# EAGLE design numpad (EAGLE 9.6.2)
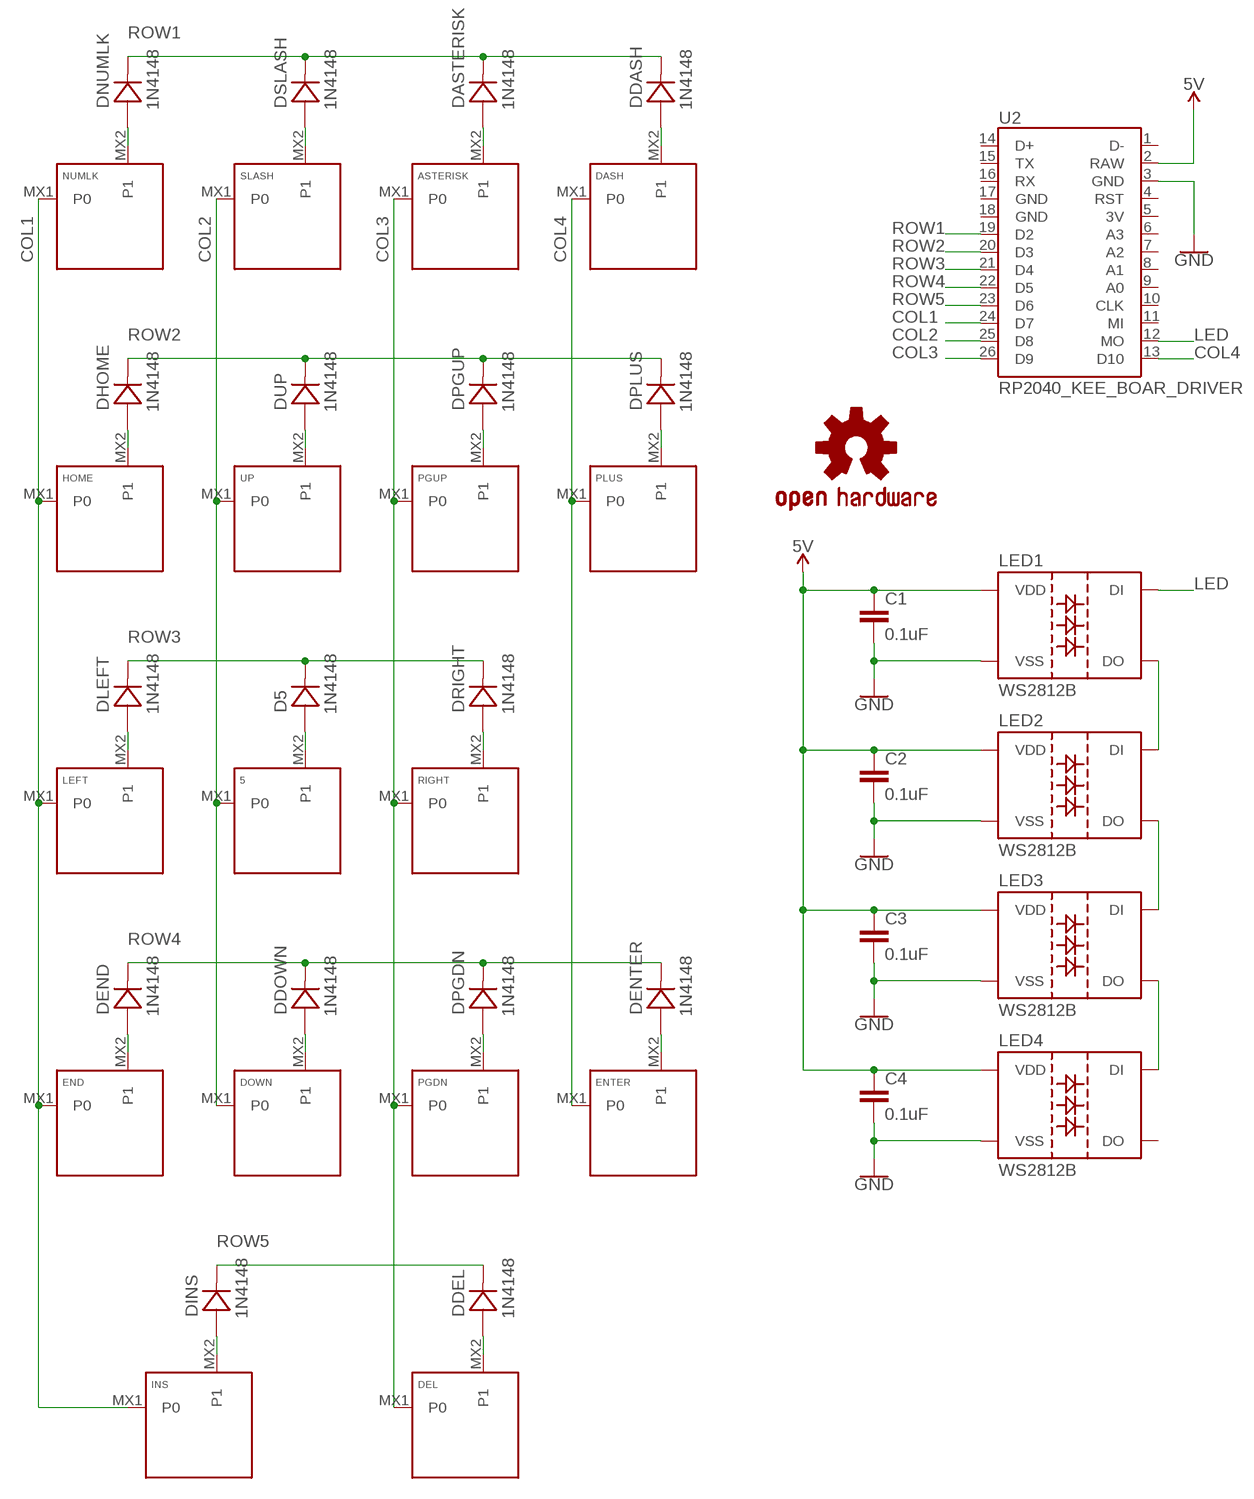
[diagram p0: schematic, sheet 1]

## Parts
5  KEYSWITCH-PLAIN-MXHSPCB-1U  [MXHSPCB-1U]
ASTERISK  KEYSWITCH-PLAIN-MXHSPCB-1U  [MXHSPCB-1U]
C1  0.1uF  0.1UF-0603-25V-(+80/-20%)  [0603]
C2  0.1uF  0.1UF-0603-25V-(+80/-20%)  [0603]
C3  0.1uF  0.1UF-0603-25V-(+80/-20%)  [0603]
C4  0.1uF  0.1UF-0603-25V-(+80/-20%)  [0603]
D5  1N4148  DIODE-DO-35  [DO-35]
DASH  KEYSWITCH-PLAIN-MXHSPCB-1U  [MXHSPCB-1U]
DASTERISK  1N4148  DIODE-DO-35  [DO-35]
DDASH  1N4148  DIODE-DO-35  [DO-35]
DDEL  1N4148  DIODE-DO-35  [DO-35]
DDOWN  1N4148  DIODE-DO-35  [DO-35]
DEL  KEYSWITCH-PLAIN-MXHSPCB-1U  [MXHSPCB-1U]
DEND  1N4148  DIODE-DO-35  [DO-35]
DENTER  1N4148  DIODE-DO-35  [DO-35]
DHOME  1N4148  DIODE-DO-35  [DO-35]
DINS  1N4148  DIODE-DO-35  [DO-35]
DLEFT  1N4148  DIODE-DO-35  [DO-35]
DNUMLK  1N4148  DIODE-DO-35  [DO-35]
DOWN  KEYSWITCH-PLAIN-MXHSPCB-1U  [MXHSPCB-1U]
DPGDN  1N4148  DIODE-DO-35  [DO-35]
DPGUP  1N4148  DIODE-DO-35  [DO-35]
DPLUS  1N4148  DIODE-DO-35  [DO-35]
DRIGHT  1N4148  DIODE-DO-35  [DO-35]
DSLASH  1N4148  DIODE-DO-35  [DO-35]
DUP  1N4148  DIODE-DO-35  [DO-35]
END  KEYSWITCH-PLAIN-MXHSPCB-1U  [MXHSPCB-1U]
ENTER  KEYSWITCH-PLAIN-MXHSPCB-2U-ROTATED  [MXHSPCB-2U-ROTATED]
HOME  KEYSWITCH-PLAIN-MXHSPCB-1U  [MXHSPCB-1U]
INS  KEYSWITCH-PLAIN-MXHSPCB-2U  [MXHSPCB-2U]
LED1  WS2812B  [WS2812B]
LED2  WS2812B  [WS2812B]
LED3  WS2812B  [WS2812B]
LED4  WS2812B  [WS2812B]
LEFT  KEYSWITCH-PLAIN-MXHSPCB-1U  [MXHSPCB-1U]
LOGO1  OSHW-LOGOM  [OSHW-LOGO-M]
NUMLK  KEYSWITCH-PLAIN-MXHSPCB-1U  [MXHSPCB-1U]
PGDN  KEYSWITCH-PLAIN-MXHSPCB-1U  [MXHSPCB-1U]
PGUP  KEYSWITCH-PLAIN-MXHSPCB-1U  [MXHSPCB-1U]
PLUS  KEYSWITCH-PLAIN-MXHSPCB-2U-ROTATED  [MXHSPCB-2U-ROTATED]
RIGHT  KEYSWITCH-PLAIN-MXHSPCB-1U  [MXHSPCB-1U]
SLASH  KEYSWITCH-PLAIN-MXHSPCB-1U  [MXHSPCB-1U]
U2  RP2040_KEE_BOAR_DRIVER  [RP2040_KEE_BOAR_DRIVER]
UP  KEYSWITCH-PLAIN-MXHSPCB-1U  [MXHSPCB-1U]

## Nets
5V: C1.1 C2.1 C3.1 C4.1 LED1.1(VDD) LED2.1(VDD) LED3.1(VDD) LED4.1(VDD) U2.2(RAW)
COL1: END.MX1(P0) HOME.MX1(P0) INS.MX1(P0) LEFT.MX1(P0) NUMLK.MX1(P0) U2.24(D7)
COL2: 5.MX1(P0) DOWN.MX1(P0) SLASH.MX1(P0) U2.25(D8) UP.MX1(P0)
COL3: ASTERISK.MX1(P0) DEL.MX1(P0) PGDN.MX1(P0) PGUP.MX1(P0) RIGHT.MX1(P0) U2.26(D9)
COL4: DASH.MX1(P0) ENTER.MX1(P0) PLUS.MX1(P0) U2.13(D10)
GND: C1.2 C2.2 C3.2 C4.2 LED1.3(VSS) LED2.3(VSS) LED3.3(VSS) LED4.3(VSS) U2.3(GND)
LED: LED1.4(DI) U2.12(MO)
N$1: DNUMLK.A NUMLK.MX2(P1)
N$2: DSLASH.A SLASH.MX2(P1)
N$3: ASTERISK.MX2(P1) DASTERISK.A
N$4: DASH.MX2(P1) DDASH.A
N$5: DHOME.A HOME.MX2(P1)
N$6: DUP.A UP.MX2(P1)
N$7: DPGUP.A PGUP.MX2(P1)
N$8: DPLUS.A PLUS.MX2(P1)
N$9: DLEFT.A LEFT.MX2(P1)
N$10: 5.MX2(P1) D5.A
N$11: DRIGHT.A RIGHT.MX2(P1)
N$12: DEND.A END.MX2(P1)
N$13: DDOWN.A DOWN.MX2(P1)
N$14: DPGDN.A PGDN.MX2(P1)
N$15: DENTER.A ENTER.MX2(P1)
N$16: DINS.A INS.MX2(P1)
N$17: DDEL.A DEL.MX2(P1)
N$18: LED1.2(DO) LED2.4(DI)
N$19: LED2.2(DO) LED3.4(DI)
N$20: LED3.2(DO) LED4.4(DI)
ROW1: DASTERISK.C DDASH.C DNUMLK.C DSLASH.C U2.19(D2)
ROW2: DHOME.C DPGUP.C DPLUS.C DUP.C U2.20(D3)
ROW3: D5.C DLEFT.C DRIGHT.C U2.21(D4)
ROW4: DDOWN.C DEND.C DENTER.C DPGDN.C U2.22(D5)
ROW5: DDEL.C DINS.C U2.23(D6)
Unconnected: LED4.2(DO) U2.1(D-) U2.4(RST) U2.5(3V) U2.6(A3) U2.7(A2) U2.8(A1) U2.9(A0) U2.10(CLK) U2.11(MI) U2.14(D+) U2.15(TX) U2.16(RX) U2.17(GND) U2.18(GND)

## Library data of the parts
5 ASTERISK DASH DEL DOWN END ENTER HOME INS LEFT NUMLK PGDN PGUP PLUS RIGHT SLASH UP = Keyboard:KEYSWITCH-PLAIN
C1-C4 = SparkFun-Capacitors:0.1UF: 0.1µF ceramic capacitors A capacitor is a passive two-terminal electrical component used to store electrical energy temporarily in an electric field.; PROD_ID: CAP-00810
D5 DASTERISK DDASH DDEL DDOWN DEND DENTER DHOME DINS DLEFT DNUMLK DPGDN DPGUP DPLUS DRIGHT DSLASH DUP = Controller:DIODE: Standard 1N4148 diode
LED1-LED4 = WS2812:WS2812B
LOGO1 = SparkFun-Aesthetics:OSHW-LOGO: Open-Source Hardware (OSHW) Logo This logo indicates the piece of hardware it is found on incorporates a OSHW license and/or adheres to the definition of open source hardware found here: http://freedomdefined.org/OSHW
U2 = RP2040_KEE_BOAR_DRIVER:RP2040_KEE_BOAR_DRIVER

## Net classes
0 default: width 0.203 mm, clearance 0.203 mm

## Board
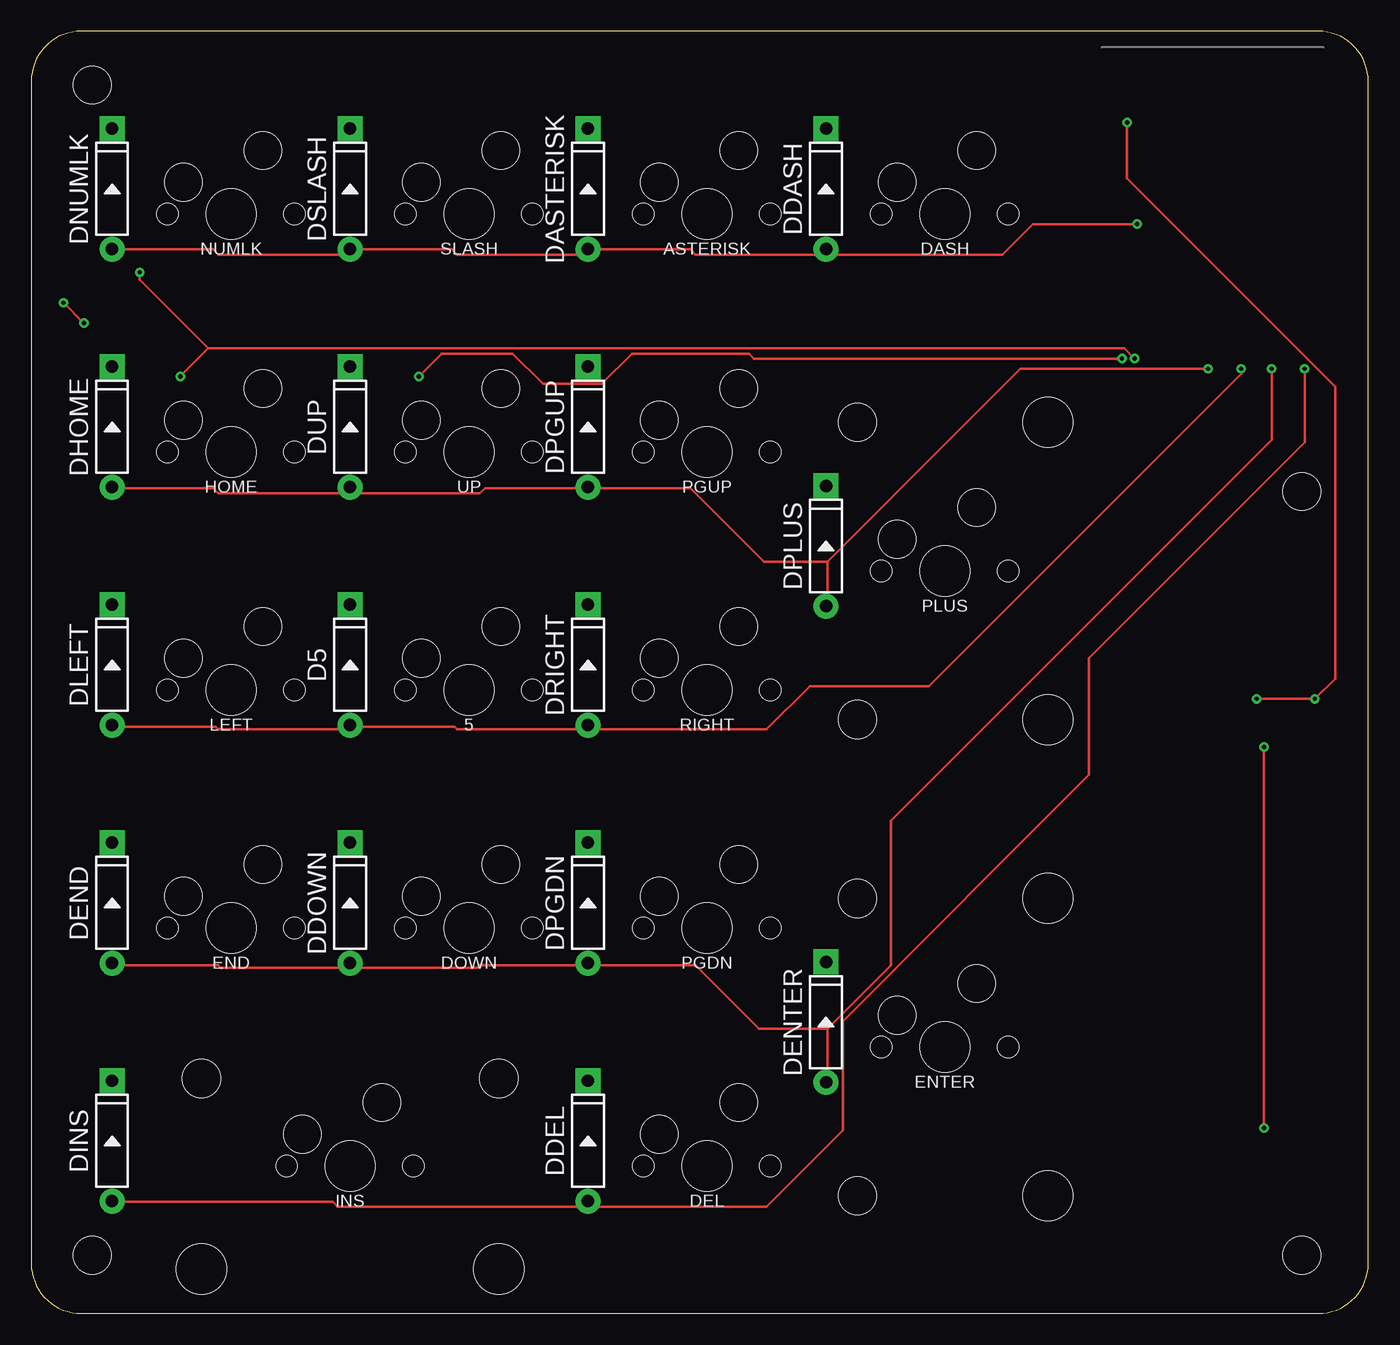
[diagram p1: board, top side]
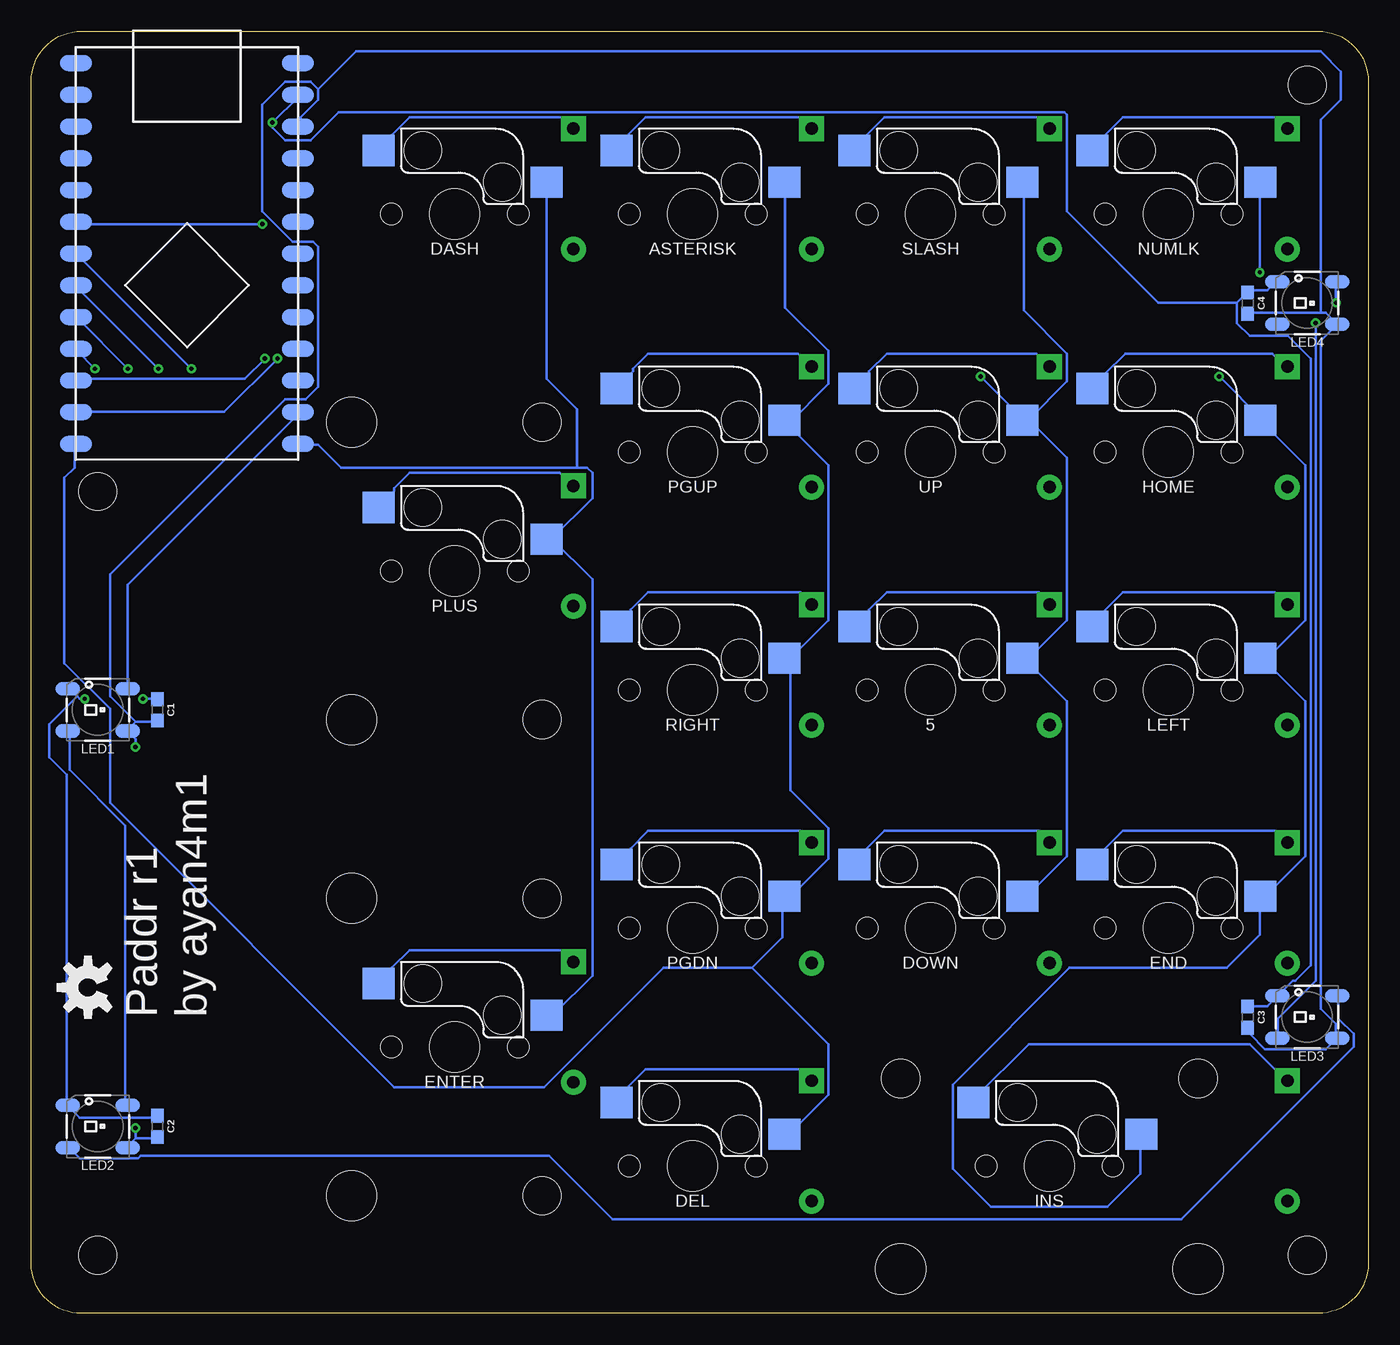
[diagram p2: board, bottom side, seen from below]

Size 107.05 x 102.62 mm. Coordinates in mm from the lower left corner, seen from the top.
Outline: 107.05,4 107.05,98.62 arc90 103.05,102.62 4,102.62 arc90 0,98.62 0,4 arc90 4,0 103.05,0 arc90 107.05,4
Copper layers (1*16): Top 0.035mm / dielectric 0.15mm / Bottom 0.035mm
Design rules "default *": minimum track width 6mil, minimum drill 0.35mm, track to track 8mil, track to pad 8mil, pad to pad 8mil, via to via 8mil, smd to smd 8mil, copper to edge 40mil, drill to drill 6mil, minimum pad ring 10mil, minimum via ring 8mil, stop-mask expansion 4mil, vias tented up to drill 0mil, thermal gap 10mil
Holes 3 mm at 4.89,4.66 101.72,4.66 101.72,65.78 4.89,98.32

### Footprints (pad centres in the part's own frame; a part is rotated, then mirrored left to right if it is on the bottom)
MXHSPCB-1U = smd 2.55 x 2.5: MX1 7.36,2.54; MX2 -6.09,5.08 | hole 4: 0,0 | hole 1.7: 5.08,0; -5.08,0 | hole 3: 3.81,2.54; -2.54,5.08
0603 = smd 1.1 x 1: 1 -0.85,0; 2 0.85,0
DO-35 = drill 1 pad 2 square: A 4.82,0 | drill 1 pad 2: C -4.82,0
MXHSPCB-2U-ROTATED = smd 2.55 x 2.5: MX1 7.36,2.54; MX2 -6.09,5.08 | hole 4: 0,0; -8.24,-11.9; -8.24,11.9 | hole 1.7: 5.08,0; -5.08,0 | hole 3: 3.81,2.54; -2.54,5.08 | hole 3.05: 7,-11.9; 7,11.9
MXHSPCB-2U = smd 2.55 x 2.5: MX1 7.36,2.54; MX2 -6.09,5.08 | hole 4: 0,0; -11.9,-8.24; 11.9,-8.24 | hole 1.7: 5.08,0; -5.08,0 | hole 3: 3.81,2.54; -2.54,5.08 | hole 3.05: -11.9,7; 11.9,7
WS2812B = smd 2 x 1.1: 1 -2.4,1.7; 2 -2.4,-1.7; 3 2.4,-1.7; 4 2.4,1.7
RP2040_KEE_BOAR_DRIVER = smd 2.54 x 1.27 bottom: 1 -8.89,15.24; 2 -8.89,12.7; 3 -8.89,10.16; 4 -8.89,7.62; 5 -8.89,5.08; 6 -8.89,2.54; 7 -8.89,0; 8 -8.89,-2.54; 9 -8.89,-5.08; 10 -8.89,-7.62; 11 -8.89,-10.16; 12 -8.89,-12.7; 13 -8.89,-15.24; 14 8.89,15.24; 15 8.89,12.7; 16 8.89,10.16; 17 8.89,7.62; 18 8.89,5.08; 19 8.89,2.54; 20 8.89,0; 21 8.89,-2.54; 22 8.89,-5.08; 23 8.89,-7.62; 24 8.89,-10.16; 25 8.89,-12.7; 26 8.89,-15.24

### Placement (x,y rotation side)
5  35.05,49.9 0 bottom
ASTERISK  54.1,88 0 bottom
C1  96.96,48.31 270 bottom
C2  96.96,14.97 270 bottom
C3  9.65,23.71 270 bottom
C4  9.65,80.86 270 bottom
D5  25.53,51.9 90 top
DASH  73.15,88 0 bottom
DASTERISK  44.58,90 90 top
DDASH  63.63,90 90 top
DDEL  44.58,13.8 90 top
DDOWN  25.53,32.85 90 top
DEL  54.1,11.8 0 bottom
DEND  6.47,32.85 90 top
DENTER  63.63,23.32 90 top
DHOME  6.47,70.95 90 top
DINS  6.47,13.8 90 top
DLEFT  6.47,51.9 90 top
DNUMLK  6.47,90 90 top
DOWN  35.05,30.85 0 bottom
DPGDN  44.58,32.85 90 top
DPGUP  44.58,70.95 90 top
DPLUS  63.63,61.42 90 top
DRIGHT  44.58,51.9 90 top
DSLASH  25.53,90 90 top
DUP  25.53,70.95 90 top
END  16,30.85 0 bottom
ENTER  73.15,21.32 0 bottom
HOME  16,68.95 0 bottom
INS  25.53,11.8 0 bottom
LED1  101.72,48.31 0 bottom
LED2  101.72,14.97 0 bottom
LED3  4.89,23.71 0 bottom
LED4  4.89,80.86 0 bottom
LEFT  16,49.9 0 bottom
LOGO1  102.52,26.09 90 bottom
NUMLK  16,88 0 bottom
PGDN  54.1,30.85 0 bottom
PGUP  54.1,68.95 0 bottom
PLUS  73.15,59.42 0 bottom
RIGHT  54.1,49.9 0 bottom
SLASH  35.05,88 0 bottom
U2  94.58,84.83 0 top
UP  35.05,68.95 0 bottom

### Tracks (layer width: path | path; a pad name or v marks a point on that pad's centre or on a via)
5V  (via drill 0.35)
  Top 0.203: v98.09,49.19 v102.77,49.19 104.39,50.81 104.39,74.18 87.73,90.84 v87.73,95.31
  Bottom 0.203: C3.1 9.5,24.6 8.07,24.6 7.47,25.21 LED3.1 7.26,25.41 6.04,26.63 5.84,26.63 4.62,27.85 4.62,76.42 6.45,78.25 9.5,78.25 10.51,79.26 10.51,80.89 | LED4.1 7.47,82.51 8.07,81.9 9.5,81.9 C4.1 9.7,81.7 10.51,80.89 | C2.1 97.08,15.66 103.17,15.66 103.99,16.47 LED2.1 104.19,16.68 104.19,43.09 105.61,44.52 105.61,47.16 103.38,49.39 | v98.09,49.19 97.08,49.19 C1.1 | v102.77,49.19 103.17,49.19 103.38,49.39 | 103.38,49.39 103.99,50 LED1.1 | U2.2 85.7,97.35 v87.73,95.31 87.73,94.91 86.71,93.89 84.68,93.89 82.45,96.13 24.33,96.13 24.13,95.92 24.13,88.2 16.81,80.89 10.51,80.89
COL1  (via drill 0.35)
  Top 0.203: v88.34,76.42 87.53,77.23 14.17,77.23 | v11.94,75 14.17,77.23 | v8.68,83.33 8.68,82.72 14.17,77.23
  Bottom 0.203: 8.28,52.24 8.48,52.44 LEFT.MX1 8.28,52.24 | 8.28,52.24 5.03,48.99 5.03,36.59 8.07,33.54 8.48,33.54 END.MX1 8.68,33.34 8.68,30.29 11.33,27.65 23.93,27.65 33.27,18.3 33.27,11.6 30.22,8.55 20.88,8.55 18.23,11.19 18.23,14.24 INS.MX1 | v88.34,76.42 89.97,74.79 103.38,74.79 U2.24 | v11.94,75 8.48,71.54 HOME.MX1 8.48,71.34 5.03,67.88 5.03,55.49 8.28,52.24 | v8.68,83.33 8.68,90.44 NUMLK.MX1
COL2  (via drill 0.35)
  Top 0.203: v87.32,76.42 57.86,76.42 57.45,76.82 48.11,76.82 45.67,74.39 40.99,74.39 38.55,76.82 32.87,76.82 v31.04,75
  Bottom 0.203: 27.38,52.24 27.58,52.44 5.MX1 27.38,52.24 | 27.38,52.24 24.13,48.99 24.13,36.59 27.18,33.54 27.58,33.54 DOWN.MX1 | v87.32,76.42 91.59,72.15 103.38,72.15 U2.25 | 27.58,71.54 v31.04,75 | 27.18,71.54 24.13,74.59 24.13,76.82 27.58,80.28 27.58,90.44 SLASH.MX1 | 27.58,71.54 27.18,71.54 | 27.58,71.54 UP.MX1 27.18,71.54 | 27.38,52.24 24.13,55.49 24.13,68.49 27.18,71.54
COL3
  Bottom 0.203: 46.28,52.44 43.23,55.49 43.23,67.88 46.48,71.13 | 46.48,71.13 46.68,71.34 PGUP.MX1 46.48,71.13 | 46.48,71.13 43.23,74.39 43.23,77.03 46.68,80.48 46.68,90.44 ASTERISK.MX1 | 49.33,27.65 56.44,27.65 65.99,18.1 77.98,18.1 100.73,40.86 100.73,48.38 104.39,52.03 104.39,66.87 103.58,67.68 103.58,69.51 U2.26 | 49.33,27.65 46.89,30.09 46.89,33.34 PGDN.MX1 46.68,33.54 46.07,33.54 43.23,36.39 43.23,38.83 46.28,41.87 46.28,52.44 | 49.33,27.65 43.23,21.55 43.23,17.49 46.28,14.44 46.68,14.44 DEL.MX1 | 46.28,52.44 RIGHT.MX1
COL4
  Bottom 0.203: 63.35,67.68 62.53,67.68 62.13,67.27 62.13,65.24 65.38,61.99 | 63.35,67.68 82.24,67.68 84.07,69.51 85.49,69.51 U2.13 | 65.38,61.99 65.78,61.99 PLUS.MX1 65.38,61.99 | 65.38,61.99 62.13,58.74 62.13,27.04 65.17,23.99 65.78,23.99 ENTER.MX1 | 63.35,67.68 63.35,72.35 65.78,74.79 65.78,90.44 DASH.MX1
GND  (via drill 0.35)
  Top 0.203: v98.7,45.33 v98.7,14.85
  Bottom 0.203: C3.2 9.5,22.77 9.5,22.37 8.28,21.15 3.4,21.15 2.59,21.96 LED3.3 2.59,22.16 2.59,23.18 3.81,24.4 3.81,77.84 2.59,79.06 LED4.3 2.59,79.26 3.4,80.08 3.81,80.08 | 3.81,80.08 9.5,80.08 C4.2 | 98.7,14.03 97.08,14.03 C2.2 | 98.7,14.03 99.31,13.43 LED2.3 | 98.7,47.36 97.08,47.36 C1.2 | 98.7,47.36 99.31,46.75 LED1.3 99.31,46.55 98.7,45.94 v98.7,45.33 | 84.07,97.96 84.07,97.14 85.49,95.72 85.49,95.11 U2.3 | 84.07,97.96 84.68,98.57 86.71,98.57 88.54,96.74 88.54,88.2 86.1,85.77 84.48,85.77 84.07,85.36 84.07,74.18 85.09,73.17 86.71,73.17 100.73,59.15 100.73,49.39 98.7,47.36 | v98.7,14.85 98.7,14.03 | 3.81,80.08 3.81,95.52 2.18,97.14 2.18,99.38 3.81,101 81.02,101 84.07,97.96
LED
  Bottom 0.203: LED1.4 99.31,50.2 99.31,58.33 85.7,71.95 U2.12
N$1
  Bottom 0.203: NUMLK.MX2 21.89,93.08 21.89,93.49 19.66,95.72 7.47,95.72 6.65,94.91 DNUMLK.A
N$2
  Bottom 0.203: SLASH.MX2 40.99,93.08 40.99,93.49 38.76,95.72 26.36,95.72 25.55,94.91 DSLASH.A
N$3
  Bottom 0.203: ASTERISK.MX2 60.09,93.08 60.09,93.49 57.86,95.72 45.46,95.72 44.65,94.91 DASTERISK.A
N$4
  Bottom 0.203: DASH.MX2 79.19,93.08 78.18,94.1 78.18,94.3 76.76,95.72 64.56,95.72 63.75,94.91 DDASH.A
N$5
  Bottom 0.203: HOME.MX2 21.89,74.18 21.08,75 21.08,75.2 19.45,76.82 7.67,76.82 6.65,75.81 DHOME.A
N$6
  Bottom 0.203: UP.MX2 40.99,74.18 39.98,75.2 39.98,75.4 38.55,76.82 26.57,76.82 25.55,75.81 DUP.A
N$7
  Bottom 0.203: PGUP.MX2 60.09,74.18 58.88,75.4 58.88,75.61 57.66,76.82 45.67,76.82 44.65,75.81 DPGUP.A
N$8
  Bottom 0.203: PLUS.MX2 79.19,64.63 77.98,65.85 77.98,66.05 76.76,67.27 64.77,67.27 63.75,66.26 DPLUS.A
N$9
  Bottom 0.203: LEFT.MX2 21.89,55.08 21.89,55.49 19.66,57.72 7.47,57.72 6.65,56.91 DLEFT.A
N$10
  Bottom 0.203: 5.MX2 40.99,55.08 39.98,56.1 39.98,56.3 38.55,57.72 26.36,57.72 25.55,56.91 D5.A
N$11
  Bottom 0.203: RIGHT.MX2 60.09,55.08 59.08,56.1 59.08,56.3 57.66,57.72 45.46,57.72 44.65,56.91 DRIGHT.A
N$12
  Bottom 0.203: END.MX2 21.89,35.98 21.89,36.39 19.66,38.62 7.47,38.62 6.65,37.81 DEND.A
N$13
  Bottom 0.203: DOWN.MX2 40.99,35.98 40.99,36.39 38.76,38.62 26.36,38.62 25.55,37.81 DDOWN.A
N$14
  Bottom 0.203: PGDN.MX2 60.09,35.98 59.08,37 59.08,37.2 57.66,38.62 45.46,38.62 44.65,37.81 DPGDN.A
N$15
  Bottom 0.203: ENTER.MX2 79.19,26.43 78.18,27.45 78.18,27.65 76.76,29.07 64.56,29.07 63.75,28.26 DENTER.A
N$16
  Bottom 0.203: INS.MX2 31.44,16.88 31.44,17.29 27.18,21.55 9.5,21.55 6.65,18.71 DINS.A
N$17
  Bottom 0.203: DEL.MX2 60.09,16.88 60.09,17.29 57.86,19.52 45.46,19.52 44.65,18.71 DDEL.A
N$18
  Bottom 0.203: LED2.4 99.52,16.68 99.52,39.03 103.99,43.5 103.99,46.55 LED1.2
N$19
  Bottom 0.203: LED3.4 2.39,25.21 2.39,23.59 1.17,22.37 1.17,21.35 14.98,7.53 60.5,7.53 65.58,12.61 98.3,12.61 98.5,12.41 103.17,12.41 103.99,13.22 LED2.2
N$20  (via drill 0.35)
  Top 0.203: v2.59,80.89 v4.21,79.26
  Bottom 0.203: v4.21,79.26 4.21,26.63 7.26,23.59 7.26,22.16 LED3.2 | v2.59,80.89 2.59,82.51 LED4.4
ROW1  (via drill 0.35)
  Top 0.203: DNUMLK.C 6.65,85.16 14.58,85.16 14.98,84.75 24.94,84.75 25.35,85.16 DSLASH.C 25.55,85.16 33.68,85.16 34.09,84.75 44.04,84.75 44.45,85.16 DASTERISK.C 44.65,85.16 52.78,85.16 53.19,84.75 63.14,84.75 63.55,85.16 DDASH.C 63.75,85.16 64.16,84.75 77.77,84.75 80.21,87.19 v88.54,87.19
  Bottom 0.203: v88.54,87.19 103.38,87.19 U2.19
ROW2  (via drill 0.35)
  Top 0.203: DHOME.C 6.65,66.05 14.58,66.05 14.98,65.65 24.94,65.65 25.35,66.05 DUP.C 25.55,66.05 25.96,65.65 35.91,65.65 36.32,66.05 44.45,66.05 DPGUP.C 44.65,66.05 52.78,66.05 58.67,60.16 63.75,60.16 | v94.23,75.61 79.19,75.61 63.75,60.16 | 63.75,60.16 63.75,56.71 DPLUS.C
  Bottom 0.203: v94.23,75.61 103.38,84.75 U2.20
ROW3  (via drill 0.35)
  Top 0.203: DLEFT.C 6.65,46.95 14.78,46.95 14.98,46.75 25.14,46.75 25.35,46.95 D5.C 25.55,46.95 33.88,46.95 34.09,46.75 44.25,46.75 44.45,46.95 DRIGHT.C 44.65,46.95 44.85,46.75 58.88,46.75 62.33,50.2 71.88,50.2 96.87,75.2 v96.87,75.61
  Bottom 0.203: v96.87,75.61 103.38,82.11 U2.21
ROW4  (via drill 0.35)
  Top 0.203: DEND.C 6.65,27.85 14.98,27.85 15.19,27.65 25.14,27.65 25.35,27.85 DDOWN.C 25.55,27.85 25.75,27.65 35.71,27.65 35.91,27.85 44.45,27.85 DPGDN.C 44.65,27.85 53.19,27.85 58.27,22.77 63.75,22.77 | v99.31,75.61 99.31,69.91 68.83,39.44 68.83,27.85 63.75,22.77 | 63.75,22.77 63.75,18.51 DENTER.C
  Bottom 0.203: v99.31,75.61 103.38,79.67 U2.22
ROW5  (via drill 0.35)
  Top 0.203: v101.95,75.61 101.95,69.71 84.68,52.44 84.68,43.09 64.97,23.38 64.97,14.64 58.88,8.55 45.06,8.55 44.65,8.95 DDEL.C 44.45,8.95 44.04,8.55 24.53,8.55 24.13,8.95 6.65,8.95 DINS.C
  Bottom 0.203: v101.95,75.61 103.38,77.03 U2.23

### Text on the board
bNames: by ayan4m1 | Paddr r1